# Altium schematic sheet ESP-WROOM-32.SchDoc
size A4
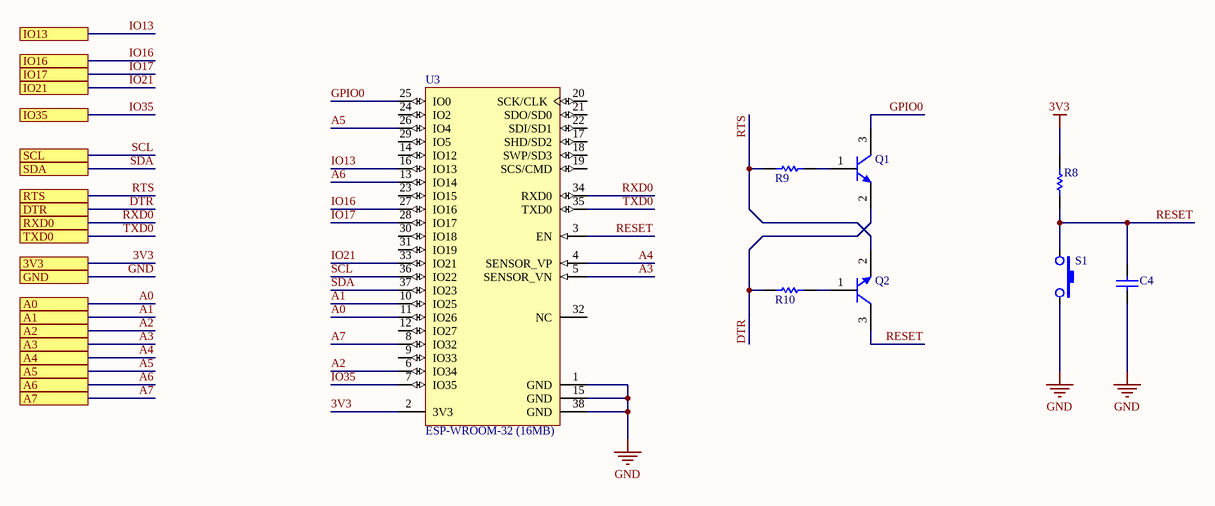
[diagram p0: ESP-WROOM-32.SchDoc]

## Parts
C4  C0805C105K4RAC7800  [CAPC2013X145X50NL20T25]  (value not drawn)
Q1  MMBT2222ALT1G  [ONSC-SOT-23-3-318-08_V]  (value not drawn)
Q2  MMBT2222ALT1G  [ONSC-SOT-23-3-318-08_V]  (value not drawn)
R8  RK73B2ATTD103J  [RESC2013X60X30NL20T20]  (value not drawn)
R9  RK73B2ATTD103J  [RESC2013X60X30NL20T20]  (value not drawn)
R10  RK73B2ATTD103J  [RESC2013X60X30NL20T20]  (value not drawn)
S1  PTS820J25MSMTRLFS  [SMT_SW_PTS_820]  (value not drawn)
U3  ESP-WROOM-32 (16MB)  [OLMX-ESP-WROOM-32]

## Ports
3V3, A0, A1, A2, A3, A4, A5, A6, A7, DTR, GND, IO13, IO16, IO17, IO21, IO35, RTS, RXD0, SCL, SDA, TXD0

## Nets
3V3: R8.2 U3.2(3V3) ; port 3V3
GND: C4.1 S1.2 U3.1(GND) U3.15(GND) U3.38(GND) ; port GND
A0: U3.11(IO26) ; port A0
A1: U3.10(IO25) ; port A1
A2: U3.6(IO34) ; port A2
A3: U3.5(SENSOR_VN) ; port A3
A4: U3.4(SENSOR_VP) ; port A4
A5: U3.26(IO4) ; port A5
A6: U3.13(IO14) ; port A6
A7: U3.8(IO32) ; port A7
DTR: Q1.2(E) R10.2 ; port DTR
GPIO0: Q1.3(C) U3.25(IO0)
IO13: U3.16(IO13) ; port IO13
IO16: U3.27(IO16) ; port IO16
IO17: U3.28(IO17) ; port IO17
IO21: U3.33(IO21) ; port IO21
IO35: U3.7(IO35) ; port IO35
RESET: C4.2 Q2.3(C) R8.1 S1.1 U3.3(EN)
RTS: Q2.2(E) R9.2 ; port RTS
RXD0: U3.34(RXD0) ; port RXD0
SCL: U3.36(IO22) ; port SCL
SDA: U3.37(IO23) ; port SDA
TXD0: U3.35(TXD0) ; port TXD0
NetQ1_1: Q1.1(B) R9.1
NetQ2_1: Q2.1(B) R10.1

Not connected (* = marked no-connect by the designer): U3 9(IO33) 12(IO27) 14(IO12) 17(SHD/SD2) 18(SWP/SD3) 19(SCS/CMD) 20(SCK/CLK) 21(SDO/SD0) 22(SDI/SD1) 23(IO15) 24(IO2) 29(IO5) 30(IO18) 31(IO19) 32(NC)

## Library data of the parts
C4 = CMP-2007-01082-1: 1µF ±10% 16V Ceramic Capacitor X7R 0805 (2012 Metric); Manufacturer: Kemet; Part Number: C0805C105K4RAC7800
Q1 Q2 = CMP-1048-00538-1: General Purpose Transistor, NPN Silicon, 3-Pin SOT-23, Pb-Free, Tape and Reel; Manufacturer: On Semiconductor; fT Min (MHz): 300; IC Continuous (A): 0.6; ComponentLink3URL: http://www.onsemi.cn/pub_link/Collateral/318-08.PDF; PartNumber: MMBT2222ALT1G; RoHS: TRUE; ComponentLink1URL: http://www.onsemi.com/; ComponentLink3Description: Package Specification; ComponentLink2Description: Datasheet; Mounting Technology: Surface Mount; Packing: Tape and Reel; PackageDescription: 3-Pin Small Outline Transistor, Body 2.92 x 1.3 mm, Pitch 0.95 mm; DatasheetVersion: Rev. 10; PackageReference: SOT-23-3-318-08; ComponentLink2URL: http://www.onsemi.cn/pub_link/Collateral/MMBT2222LT1-D.PDF; Polarity: NPN; PackageVersion: Rev. AP, 11/2009; ComponentLink1Description: Manufacturer URL
R8-R10 = CMP-2001-04657-1: 10 kOhms ±5% 0.25W, 1/4W Chip Resistor 0805 (2012 Metric) Automotive AEC-Q200, Moisture Resistant Thick Film; Manufacturer: KOA Speer; Part Number: RK73B2ATTD103J
S1 = PTS820J25MSMTRLFS: Tactile Switch SPST-NO Top Actuated Surface Moun
U3 = CMP-2000-07454-1: Espressif System, 2.7 to 3.6 V, -40 to 85 degC, 38-Pin SMD; Package Description: 38-Pin Surface Mount Device, Body 18 x 25.5 mm, Pitch 1.27 mm; RoHSCompliant: false; Mounting Technology: SurfaceMount; Package Reference: ESP-WROOM-32 (16MB)